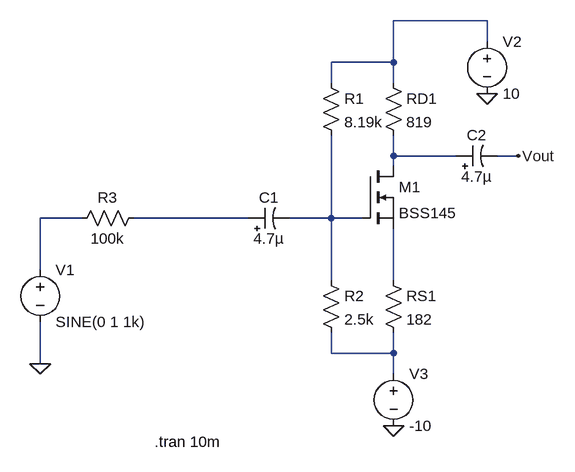
[diagram p0: schematic lab5.3c.asc]
lab5.3c.asc, the LTspice schematic file:
Version 4
SHEET 1 880 680
WIRE 272 -176 128 -176
WIRE 272 -144 272 -176
WIRE 128 -112 128 -176
WIRE 128 -112 32 -112
WIRE 32 -80 32 -112
WIRE 128 -80 128 -112
WIRE 128 32 128 0
WIRE 224 32 128 32
WIRE 320 32 288 32
WIRE 128 48 128 32
WIRE -352 128 -416 128
WIRE -96 128 -272 128
WIRE 32 128 32 0
WIRE 32 128 -32 128
WIRE 80 128 32 128
WIRE -416 208 -416 128
WIRE 32 224 32 128
WIRE 128 224 128 144
WIRE 32 336 32 304
WIRE 128 336 128 304
WIRE 128 336 32 336
WIRE -416 352 -416 288
WIRE 128 368 128 336
FLAG -416 352 0
FLAG 272 -64 0
FLAG 128 448 0
FLAG 320 32 Vout
SYMBOL voltage -416 192 R0
WINDOW 123 0 0 Left 0
WINDOW 39 0 0 Left 0
SYMATTR InstName V1
SYMATTR Value SINE(0 1 1k)
SYMBOL polcap -96 144 R270
WINDOW 0 32 32 VTop 2
WINDOW 3 0 32 VBottom 2
SYMATTR InstName C1
SYMATTR Value 4.7µ
SYMATTR Description Capacitor
SYMATTR Type cap
SYMATTR SpiceLine V=25 Irms=24m Rser=5 Lser=0 mfg="Nichicon" pn="UPR1E4R7MAH" type="Al electrolytic"
SYMBOL res 16 -96 R0
SYMATTR InstName R1
SYMATTR Value 8.19k
SYMBOL res 16 208 R0
SYMATTR InstName R2
SYMATTR Value 2.5k
SYMBOL nmos 80 48 R0
SYMATTR InstName M1
SYMATTR Value BSS145
SYMBOL res 112 -96 R0
SYMATTR InstName RD1
SYMATTR Value 819
SYMBOL res 112 208 R0
SYMATTR InstName RS1
SYMATTR Value 182
SYMBOL polcap 224 48 R270
WINDOW 0 32 32 VTop 2
WINDOW 3 0 32 VBottom 2
SYMATTR InstName C2
SYMATTR Value 4.7µ
SYMATTR Description Capacitor
SYMATTR Type cap
SYMATTR SpiceLine V=25 Irms=24m Rser=5 Lser=0 mfg="Nichicon" pn="UPR1E4R7MAH" type="Al electrolytic"
SYMBOL voltage 272 -160 R0
WINDOW 123 0 0 Left 0
WINDOW 39 0 0 Left 0
SYMATTR InstName V2
SYMATTR Value 10
SYMBOL voltage 128 352 R0
WINDOW 123 0 0 Left 0
WINDOW 39 0 0 Left 0
SYMATTR InstName V3
SYMATTR Value -10
SYMBOL res -256 112 R90
WINDOW 0 0 56 VBottom 2
WINDOW 3 32 56 VTop 2
SYMATTR InstName R3
SYMATTR Value 100k
TEXT -240 472 Left 2 !.tran 10m

The netlist it stands for:
* lab5.3c.asc
V1 N003 0 SINE(0 1 1k)
C1 N004 N005 4.7µ V=25 Irms=24m Rser=5 Lser=0 mfg="Nichicon" pn="UPR1E4R7MAH" type="Al electrolytic"
R1 N001 N005 8.19k
R2 N005 N007 2.5k
M1 N002 N005 N006 N006 BSS145
RD1 N001 N002 819
RS1 N006 N007 182
C2 N002 Vout 4.7µ V=25 Irms=24m Rser=5 Lser=0 mfg="Nichicon" pn="UPR1E4R7MAH" type="Al electrolytic"
V2 N001 0 10
V3 N007 0 -10
R3 N004 N003 100k
.model NMOS NMOS
.model PMOS PMOS
.lib standard.mos
.tran 10m
.backanno
.end